# EasyEDA Pro project 2025_09_06_dc.epro

# Board PCB1
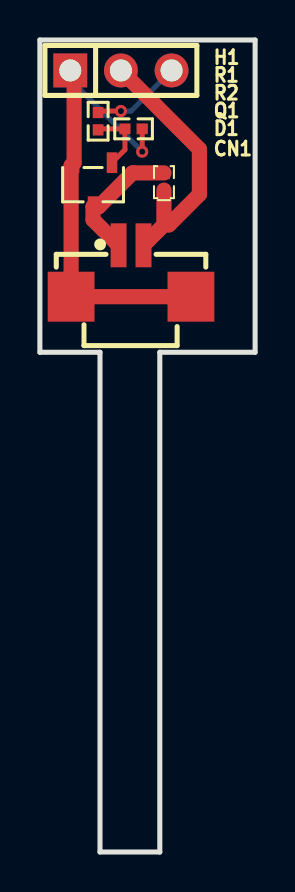
[diagram p0: board, top side]
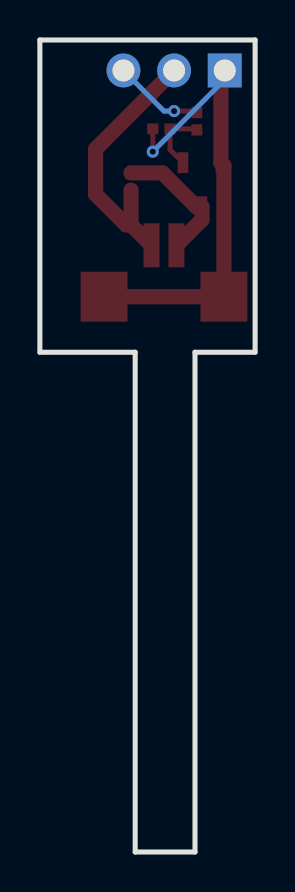
[diagram p1: board, bottom side, seen from below]

Outline 10.79 x 40.62 mm; copper layers: Top Layer, Bottom Layer. Coordinates in mm from the lower left corner of the outline.
Outline path: 0,40.62 10.79,40.62 10.79,25 6.01,25 6.01,0 3.01,0 3.01,25 0,25 0,40.62
Stack: Top Layer 0.035mm / Dielectric1 1.51mm FR4 er 4.5 / Bottom Layer 0.035mm

## Design rules (mm)
template: JLCPCB Capability(Two Layers Board)
spacing copperThickness1oz (default): track to track 0.102, other pairs 0.152 to 0.3
spacing copperThickness2oz: track to track 0.203, other pairs 0.152 to 0.3
track width copperThickness1oz (default): min 0.127, default 0.254, max 2.54
track width copperThickness2oz: min 0.203, default 0.254, max 2.54
differential pair differentialPair (default): width min 0.127, default 0.254, max 2.54; gap min 0.152, default 0.152
via viaSize (default): diameter min 0.5, default 0.61, max 10; hole min 0.3, default 0.305, max 6.3

## Placement (name value [footprint] x y rotation side)
CN1  HC-1.25-2PWT  [CONN-SMD_2P-P1.25-HC-1.25-2PWT]  4.57 29.06 0 top
D1  BAT54L,315  [DFN1006-2L-RD]  6.22 33.51 90 top
H1  PZ254V-11-03P  [HDR-TH_3P-P2.54-V-M]  4.06 39.1 0 top
Q1  CJ2302 S2  [SOT-23-3_L3.0-W1.7-P0.95-LS2.9-BR]  2.67 33.38 90 top
R1  47Ω  [R0402]  2.92 36.56 270 top
R2  10kΩ  [R0402]  4.7 36.18 180 top

## Footprints (pads in the part's own frame, mm; a bottom-side part is the same pattern mirrored in y, then rotated)
CONN-SMD_2P-P1.25-HC-1.25-2PWT
  rect 0.8x2.2 smd: 1(-0.625,1.285) 2(0.625,1.285)
  rect 2.35x2.5 smd: 3(-3.005,-1.285) 4(3.005,-1.285)
DFN1006-2L-RD
  rect 0.5x0.6 smd: 1(-0.4,0) 2(0.4,0)
HDR-TH_3P-P2.54-V-M
  rect 1.7x1.7 hole 1.1: 1(-2.54,0)
  round 1.7 hole 1.1: 2(0,0) 3(2.54,0)
R0402
  rect 0.566x0.54 smd: 1(-0.433,0) 2(0.433,0)
SOT-23-3_L3.0-W1.7-P0.95-LS2.9-BR
  rect 1.038x0.532 smd: 1(1.101,-0.95) 2(1.101,0.95) 3(-1.101,0)

## Nets
GND: CN1.3 CN1.4 H1.1 Q1.2 R2.1
VCC: CN1.2 D1.1 H1.2
MOTOR: H1.3 R1.1
$1N423: Q1.1 R1.2 R2.2
$1N473: CN1.1 D1.2 Q1.3

## Via types
v1: diameter 0.61, hole 0.305, Top Layer to Bottom Layer, 2 vias

## Routing (per net, layer and track width the routed paths; a pad name or vN(x,y) marks a point on that pad's centre or on a via; arc(x,y) is an arc through that point)
GND: length 24.2
  Top Layer w0.254: R2.1 v1(5.13,35.03)
  Top Layer w0.762: CN1.4 CN1.3 1.57,34.33 Q1.2 1.72,38.9 H1.1
  Bottom Layer w0.254: H1.1 1.52,38.64 v1(5.13,35.03)
VCC: length 13.4
  Top Layer w0.762: H1.2 8,35.16 8,32.9 6.48,31.38 6.22,31.38 ; CN1.2 6.22,31.38 ; 6.22,31.38 D1.1
MOTOR: length 4.6
  Top Layer w0.254: v1(4.06,37.06) 3,37.06 2.92,36.99
  Bottom Layer w0.254: v1(4.06,37.06) 4.57,37.06 H1.3
$1N423: length 3.3
  Top Layer w0.254: R1.2 2.97,36.18 R2.2 4.27,35.13 Q1.1
$1N473: length 6.7
  Top Layer w0.762: CN1.1 2.67,31.63 Q1.3 2.95,32.28 4.65,33.97 6.22,33.97
